# EAGLE design NGP (EAGLE 6.6.0)
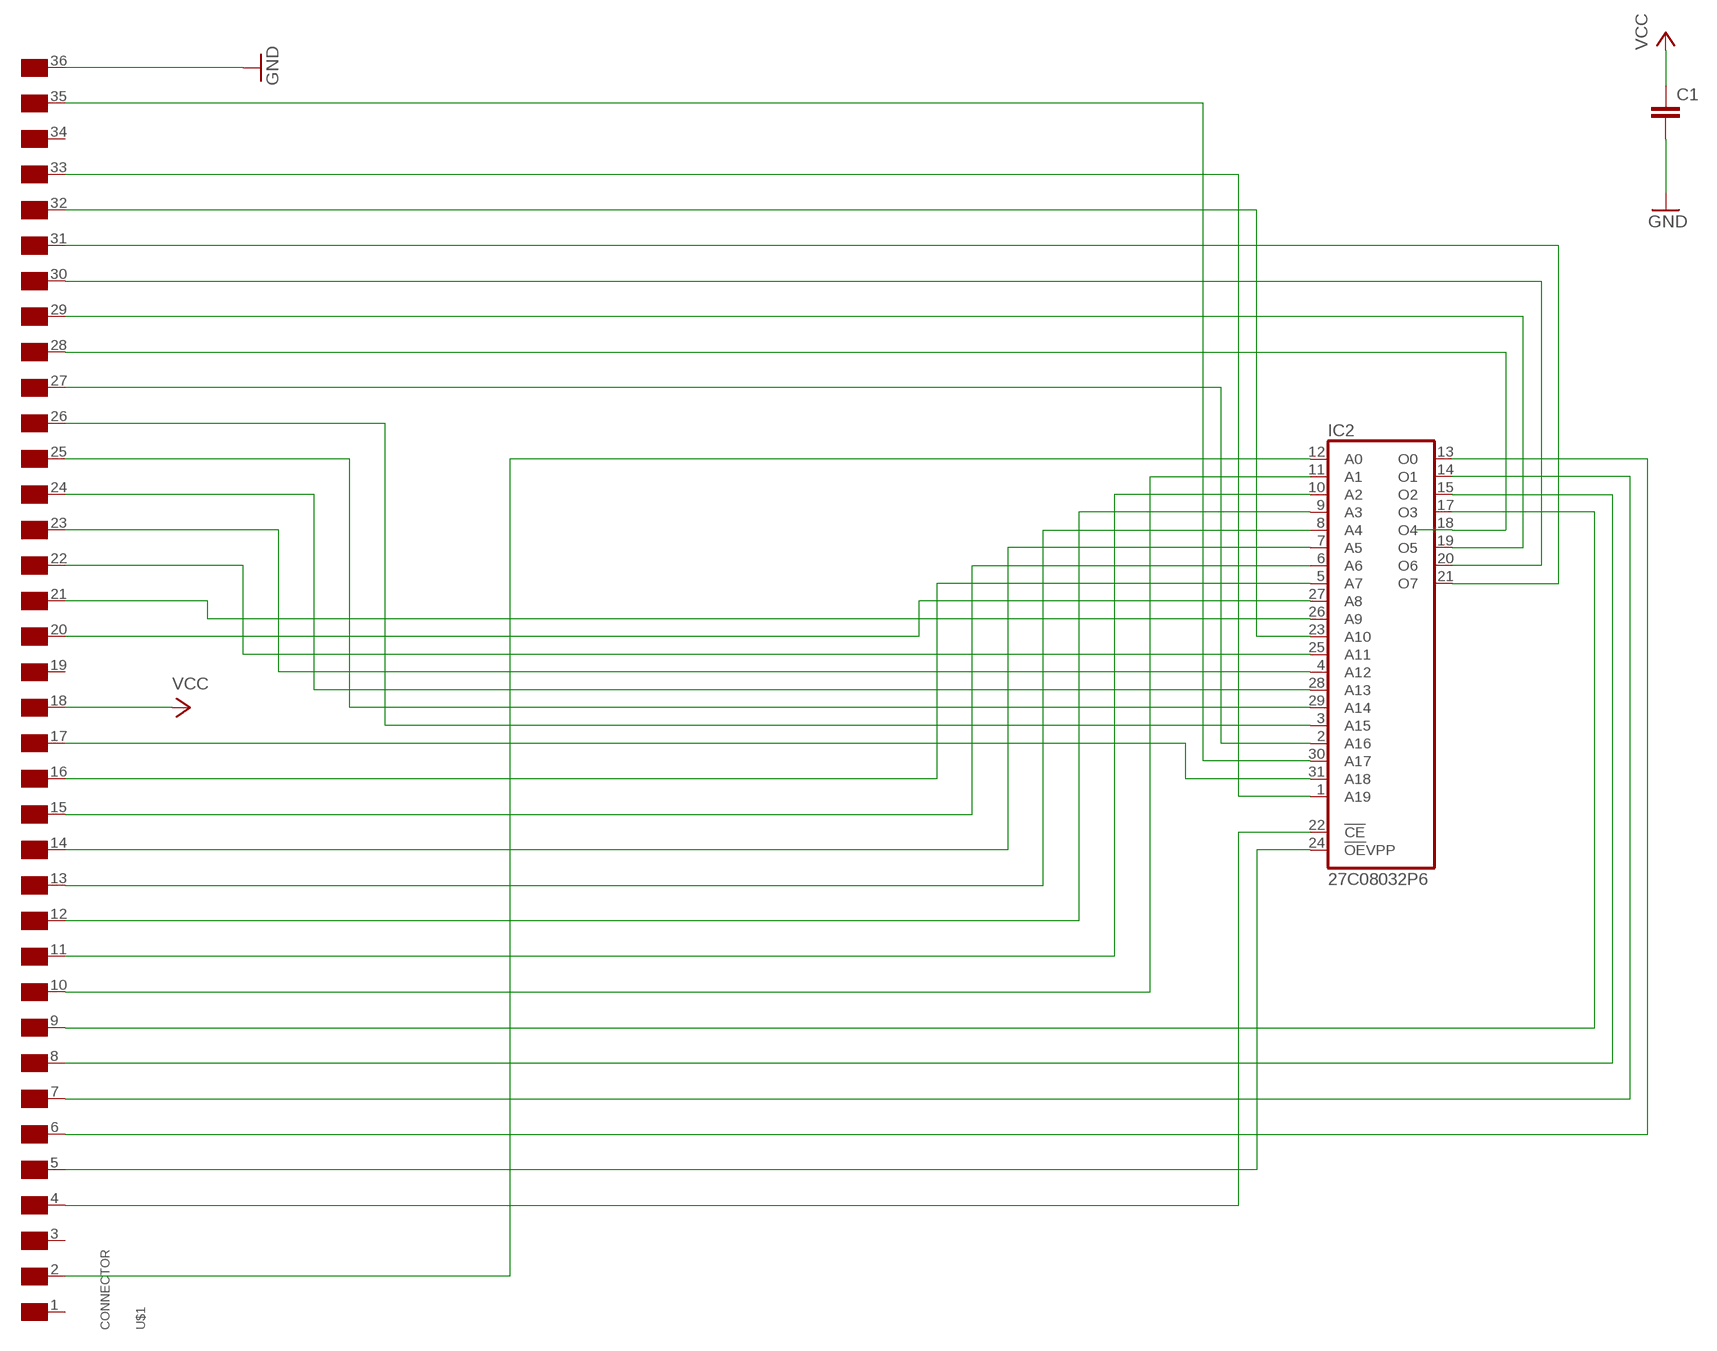
[diagram p0: schematic, sheet 1]

## Parts
C1  C-EU025-024X044  [C025-024X044]
IC2  27C08032P6  [DIL32]
U$1  CONNECTOR  [CONNECTOR]

## Nets
GND: C1.2 U$1.36(GND1)
N$1: IC2.18(O4) U$1.28(D6)
N$3: IC2.29(A14) U$1.25(D3)
N$4: IC2.12(A0) U$1.2(NC)
N$5: IC2.22(!CE) U$1.4(/RD)
N$6: IC2.24(!OE!VPP) U$1.5(/RCS)
N$7: IC2.13(O0) U$1.6(A0)
N$8: IC2.14(O1) U$1.7(A1)
N$9: IC2.15(O2) U$1.8(A2)
N$10: IC2.17(O3) U$1.9(A3)
N$11: IC2.11(A1) U$1.10(A4)
N$12: IC2.10(A2) U$1.11(A5)
N$13: IC2.9(A3) U$1.12(A6)
N$14: IC2.8(A4) U$1.13(A7)
N$15: IC2.7(A5) U$1.14(A8)
N$16: IC2.6(A6) U$1.15(A9)
N$17: IC2.5(A7) U$1.16(A10)
N$18: IC2.31(A18) U$1.17(A11)
N$19: IC2.27(A8) U$1.20(A14)
N$20: IC2.26(A9) U$1.21(A15)
N$21: IC2.25(A11) U$1.22(D0)
N$22: IC2.4(A12) U$1.23(D1)
N$23: IC2.28(A13) U$1.24(D2)
N$24: IC2.3(A15) U$1.26(D4)
N$25: IC2.2(A16) U$1.27(D5)
N$26: IC2.30(A17) U$1.35(VIN1)
N$27: IC2.1(A19) U$1.33(D8)
N$29: IC2.19(O5) U$1.29(D7)
N$30: IC2.20(O6) U$1.30(/RS)
N$31: IC2.21(O7) U$1.31(VIN)
N$32: IC2.23(A10) U$1.32(GND)
VCC: C1.1 U$1.18(A12)
Unconnected: U$1.3(/WR) U$1.19(A13) U$1.34(/RS1)

## Power pins joined to a net without a drawn wire
GND: IC2.16(GND)
VCC: IC2.32(VCC)
VDD: U$1.1(VDD)

## Library data of the parts
C1 = resistor:C-EU: CAPACITOR, European symbol
IC2 = atmel:27C080: 8-Megabit (1Mx8) OTP EPROM; MPN: AT27C080-90PU; OC_FARNELL: 1455026; OC_NEWARK: 58M3824
U$1 = gamebOY:CONNECTOR: Connector Pads for Gameboy Cartridges

## Board
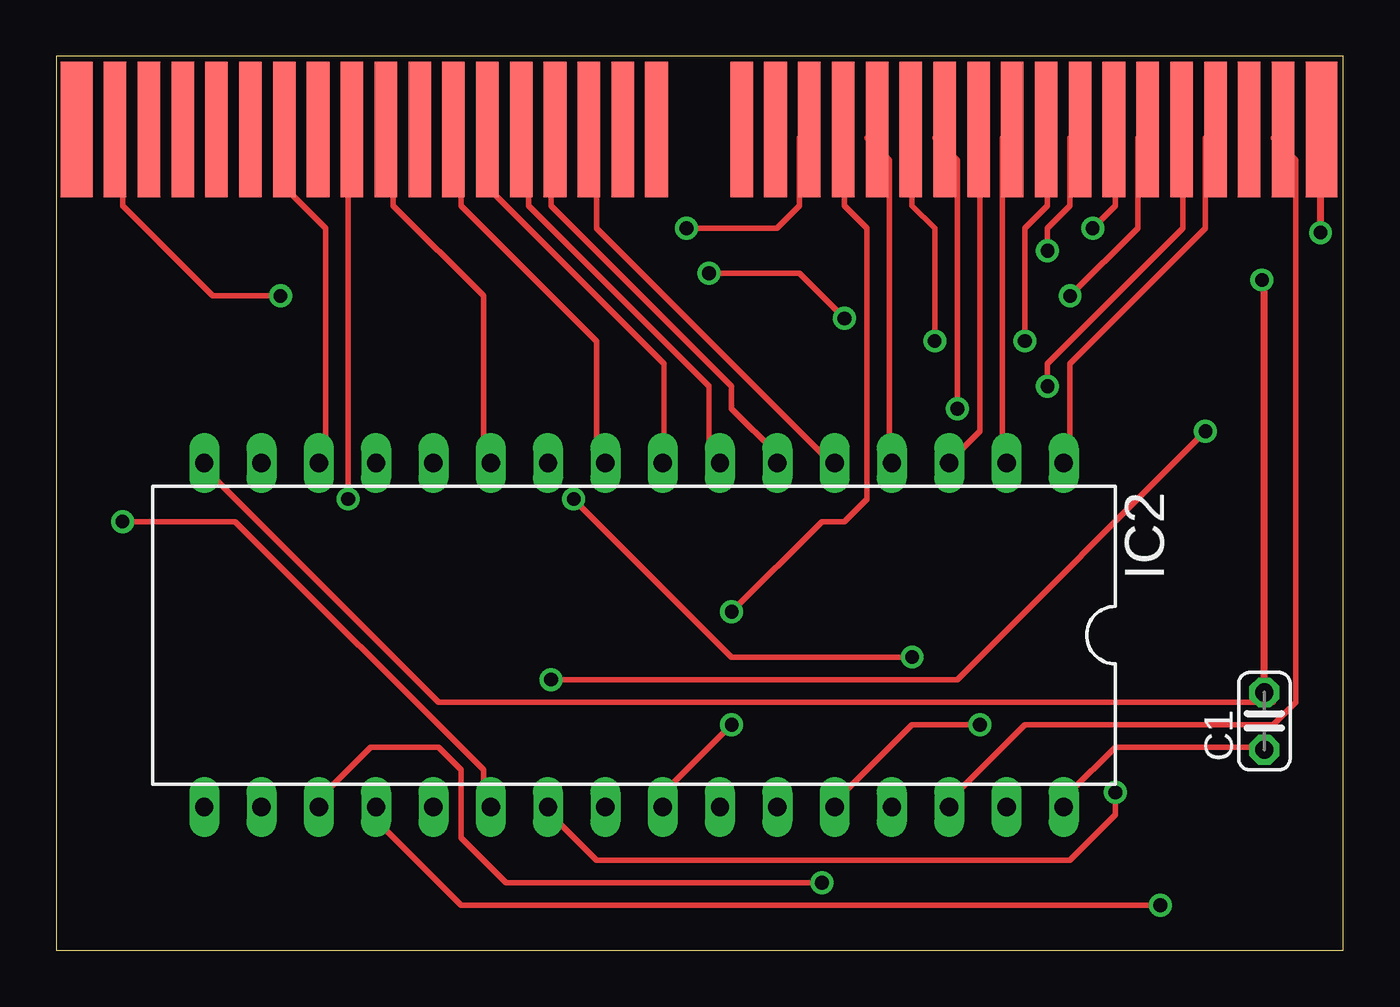
[diagram p1: board, top side]
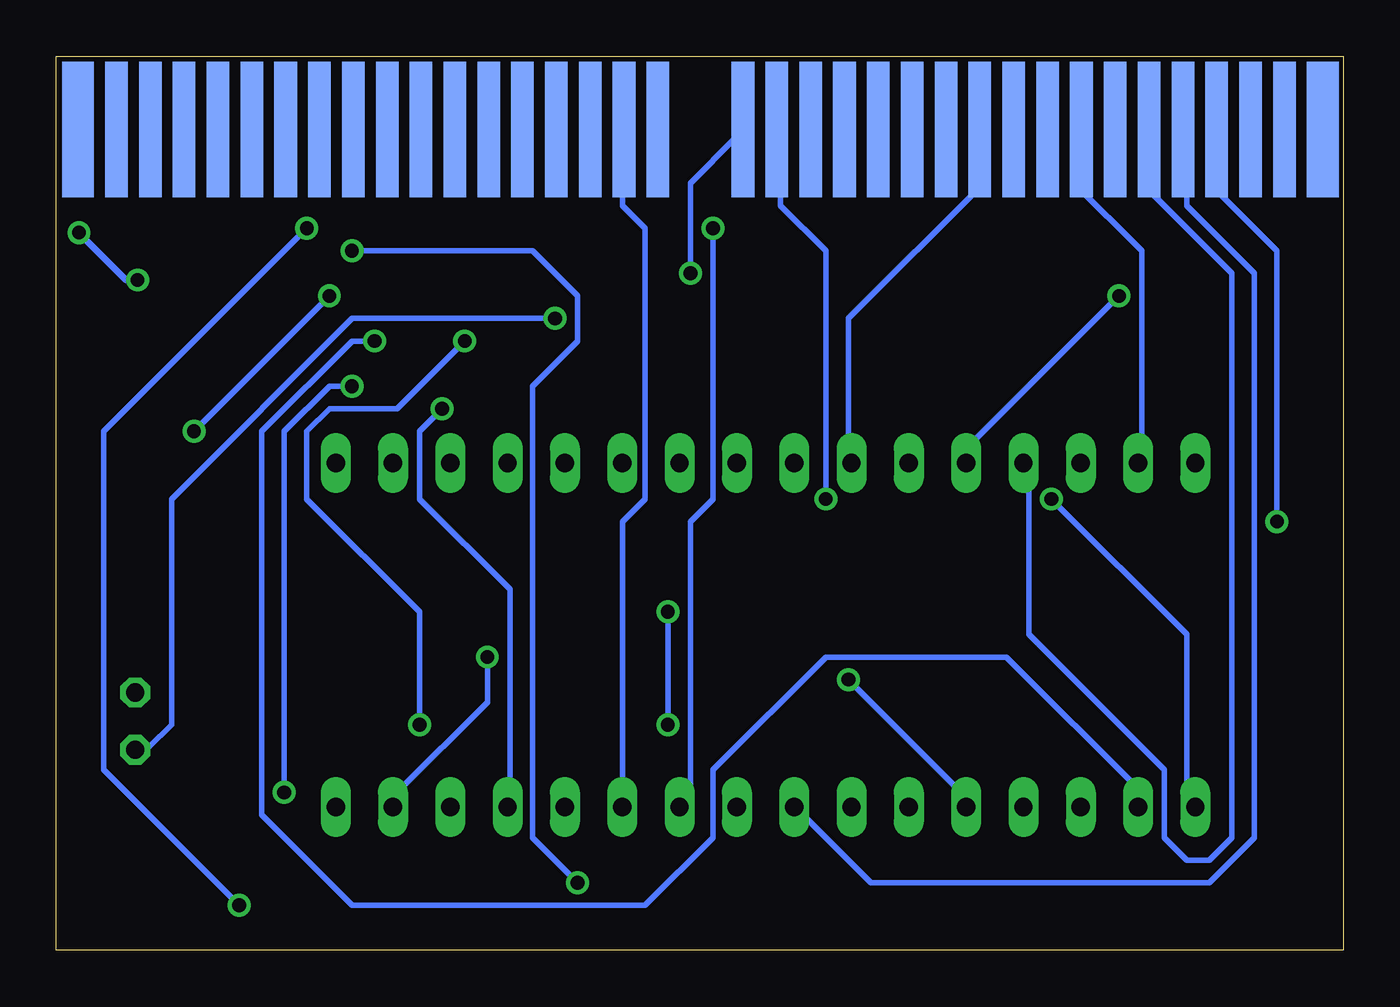
[diagram p2: board, bottom side, seen from below]

Size 57.03 x 39.61 mm. Coordinates in mm from the lower left corner, seen from the top.
Outline: 0,0 57.03,0 57.03,39.61 0,39.61 0,0
Copper layers (1*16): Top 0.035mm / dielectric 1.5mm / Bottom 0.035mm
Design rules "default": minimum track width 10mil, minimum drill 24mil, track to track 8mil, track to pad 8mil, pad to pad 8mil, via to via 8mil, smd to smd 8mil, copper to edge 40mil, drill to drill 8mil, minimum pad ring 10mil, minimum via ring 8mil, stop-mask expansion 4mil, vias tented up to drill 0mil, thermal gap 10mil

### Footprints (pad centres in the part's own frame; a part is rotated, then mirrored left to right if it is on the bottom)
C025-024X044 = drill 0.813 octagon: 1 -1.27,0; 2 1.27,0
DIL32 = drill 0.813 long: 1 -19.05,-7.62; 2 -16.51,-7.62; 3 -13.97,-7.62; 4 -11.43,-7.62; 5 -8.89,-7.62; 6 -6.35,-7.62; 7 -3.81,-7.62; 8 -1.27,-7.62; 9 1.27,-7.62; 10 3.81,-7.62; 11 6.35,-7.62; 12 8.89,-7.62; 13 11.43,-7.62; 14 13.97,-7.62; 15 16.51,-7.62; 16 19.05,-7.62; 17 19.05,7.62; 18 16.51,7.62; 19 13.97,7.62; 20 11.43,7.62; 21 8.89,7.62; 22 6.35,7.62; 23 3.81,7.62; 24 1.27,7.62; 25 -1.27,7.62; 26 -3.81,7.62; 27 -6.35,7.62; 28 -8.89,7.62; 29 -11.43,7.62; 30 -13.97,7.62; 31 -16.51,7.62; 32 -19.05,7.62
CONNECTOR = smd 1.4 x 6: 1 0.7,-3; 36 55.87,-3 | smd 1 x 6: 2 2.4,-3; 7 9.9,-3; 9 12.9,-3; 10 14.4,-3; 12 17.4,-3; 13 18.9,-3; 14 20.4,-3; 15 21.9,-3; 16 23.4,-3; 19 30.17,-3; 21 33.17,-3; 22 34.67,-3; 23 36.17,-3; 24 37.67,-3; 25 39.17,-3; 26 40.67,-3; 27 42.17,-3; 28 43.67,-3; 29 45.17,-3; 30 46.67,-3; 31 48.17,-3; 32 49.67,-3; 33 51.17,-3; 34 52.67,-3; 35 54.17,-3; 39 3.9,-3; 40 5.4,-3; 41 6.9,-3; 42 8.4,-3; 44 11.4,-3; 47 15.9,-3; 53 24.9,-3; 54 26.4,-3; 56 31.67,-3 | smd 1 x 6 bottom: 3 3.9,-3; 4 5.4,-3; 5 6.9,-3; 6 8.4,-3; 8 11.4,-3; 11 15.9,-3; 17 24.9,-3; 18 26.4,-3; 20 31.67,-3; 38 2.4,-3; 43 9.9,-3; 45 12.9,-3; 46 14.4,-3; 48 17.4,-3; 49 18.9,-3; 50 20.4,-3; 51 21.9,-3; 52 23.4,-3; 55 30.17,-3; 57 33.17,-3; 58 34.67,-3; 59 36.17,-3; 60 37.67,-3; 61 39.17,-3; 62 40.67,-3; 63 42.17,-3; 64 43.67,-3; 65 45.17,-3; 66 46.67,-3; 67 48.17,-3; 68 49.67,-3; 69 51.17,-3; 70 52.67,-3; 71 54.17,-3 | smd 1.4 x 6 bottom: 37 0.7,-3; 72 55.87,-3

### Placement (x,y rotation side)
C1  53.54,10.16 90 top
IC2  25.6,13.97 180 top
U$1  0.2,39.37 0 top

### Tracks (layer width: path | path; a pad name or v marks a point on that pad's centre or on a via)
GND  (via drill 0.6)
  Top 0.254: IC2.16 6.93,21 16.93,11 53.93,11 C1.2
  Top 0.305: C1.2 53.54,29.59 v53.43,29.7 | v56.03,31.8 56.03,36.33 U$1.36
  Bottom 0.305: v53.43,29.7 53.93,29.7 v56.03,31.8
N$1  (via drill 0.61)
  Top 0.254: v42.93,27 42.93,32 43.93,33 43.93,36 U$1.28
  Bottom 0.254: v42.93,27 43.93,27 47.93,23 47.93,6 43.93,2 30.93,2 27.93,5 27.93,8 22.93,13 14.93,13 8.93,7 IC2.18
N$3  (via drill 0.61)
  Top 0.254: v39.93,24 39.93,35 38.93,36 U$1.25
  Bottom 0.254: v39.93,24 40.93,23 40.93,20 36.93,16 36.93,7 IC2.29
N$4  (via drill 0.61)
  Top 0.254: v9.93,29 6.93,29 2.93,33 2.93,36 U$1.2
  Bottom 0.254: v9.93,29 16.93,22 IC2.12
N$5  (via drill 0.61)
  Top 0.254: v2.93,19 7.93,19 18.93,8 18.93,7 IC2.22
  Bottom 0.254: v2.93,19 2.93,31 5.93,34 5.93,36 U$1.4
N$6
  Bottom 0.254: IC2.24 23.93,6 20.93,3 5.93,3 3.93,5 3.93,30 6.93,33 6.93,36 U$1.5
N$7
  Bottom 0.254: IC2.13 13.93,21 13.93,14 7.93,8 7.93,5 6.93,4 5.93,4 4.93,5 4.93,30 8.93,34 8.93,36 U$1.6
N$8
  Top 0.254: IC2.14 11.93,22 11.93,32 9.93,34 9.93,36 U$1.7
N$9
  Bottom 0.254: IC2.15 8.93,22 8.93,31 11.93,34 11.93,36 U$1.8
N$10  (via drill 0.61)
  Top 0.254: v12.93,20 12.93,36 U$1.9
  Bottom 0.254: v12.93,20 6.93,14 6.93,7 IC2.17
N$11
  Top 0.254: IC2.11 18.93,22 18.93,29 14.93,33 14.93,36 U$1.10
N$12
  Bottom 0.254: IC2.10 21.93,22 21.93,28 15.93,34 15.93,36 U$1.11
N$13
  Top 0.254: IC2.9 23.93,22 23.93,27 17.93,33 17.93,36 U$1.12
N$14
  Top 0.254: IC2.8 26.93,22 26.93,26 18.93,34 18.93,36 U$1.13
N$15
  Top 0.254: IC2.7 28.93,22 28.93,25 20.93,33 20.93,36 U$1.14
N$16
  Top 0.254: IC2.6 31.93,22 29.93,24 29.93,25 21.93,33 21.93,36 U$1.15
N$17
  Top 0.254: IC2.5 33.93,22 23.93,32 23.93,36 U$1.16
N$18  (via drill 0.61)
  Top 0.254: v37.93,13 29.93,13 v22.93,20
  Bottom 0.254: v37.93,13 37.93,11 41.93,7 IC2.31 | v22.93,20 22.93,31 24.93,33 24.93,36 U$1.17
N$19
  Bottom 0.254: IC2.27 31.93,7 31.93,19 30.93,20 30.93,32 31.93,33 31.93,36 U$1.20
N$20  (via drill 0.61)
  Top 0.254: v27.93,32 31.93,32 32.93,33 32.93,36 U$1.21
  Bottom 0.254: v27.93,32 27.93,20 28.93,19 28.93,7 IC2.26
N$21  (via drill 0.61)
  Top 0.254: v29.93,10 26.93,7 IC2.25 | v29.93,15 33.93,19 34.93,19 35.93,20 35.93,32 34.93,33 34.93,36 U$1.22
  Bottom 0.254: v29.93,15 v29.93,10
N$22
  Top 0.254: IC2.4 36.93,22 36.93,35 35.93,36 U$1.23
N$23  (via drill 0.61)
  Top 0.254: v40.93,10 37.93,10 34.93,7 IC2.28 | v38.93,27 38.93,32 37.93,33 37.93,36 U$1.24
  Bottom 0.254: v40.93,10 40.93,15 45.93,20 45.93,23 44.93,24 41.93,24 v38.93,27
N$24
  Top 0.254: IC2.3 39.93,22 40.93,23 40.93,36 U$1.26
N$25
  Top 0.254: IC2.2 41.93,22 41.93,36 U$1.27
N$26
  Top 0.254: IC2.30 39.93,7 42.93,10 53.93,10 54.93,11 54.93,35 53.93,36 U$1.35
N$27
  Top 0.254: IC2.1 44.93,22 44.93,26 50.93,32 50.93,36 U$1.33
N$29  (via drill 0.61)
  Top 0.254: v33.93,3 19.93,3 17.93,5 17.93,8 16.93,9 13.93,9 11.93,7 IC2.19 | v43.93,31 43.93,32 44.93,33 44.93,36 U$1.29
  Bottom 0.254: v33.93,3 35.93,5 35.93,25 33.93,27 33.93,29 35.93,31 v43.93,31
N$30  (via drill 0.61)
  Top 0.254: v48.93,2 17.93,2 13.93,6 IC2.20 | v45.93,32 46.93,33 46.93,36 U$1.30
  Bottom 0.254: v48.93,2 54.93,8 54.93,23 v45.93,32
N$31  (via drill 0.61)
  Top 0.254: v21.93,12 39.93,12 v50.93,23 | v44.93,29 47.93,32 47.93,36 U$1.31
  Bottom 0.254: v21.93,12 16.93,7 IC2.21 | v44.93,29 v50.93,23
N$32  (via drill 0.61)
  Top 0.254: v46.93,7 46.93,6 44.93,4 23.93,4 21.93,6 IC2.23 | v43.93,25 43.93,26 49.93,32 49.93,36 U$1.32
  Bottom 0.254: v46.93,7 46.93,23 44.93,25 v43.93,25
VCC  (via drill 0.61)
  Top 0.254: IC2.32 44.93,7 46.93,9 52.93,9 C1.1 | v28.93,30 32.93,30 v34.93,28
  Bottom 0.254: v28.93,30 28.93,34 26.93,36 U$1.18 | v34.93,28 43.93,28 51.93,20 51.93,10 52.93,9 C1.1